# EAGLE schematic common emitter-punto di lavoro (EAGLE 9.6.2)
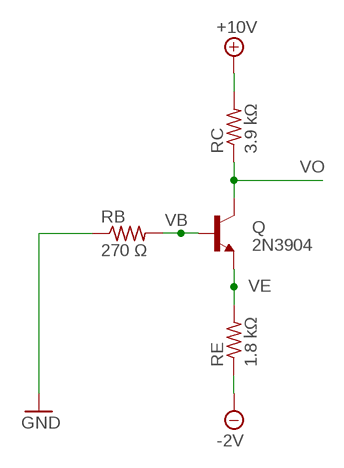
[diagram p0: schematic, sheet 1]

## Parts
Q  2N3904  [TO92]
RB  270 Ω  R-US_0204/5  [0204/5]
RC  3.9 kΩ  R-US_0204/5  [0204/5]
RE  1.8 kΩ  R-US_0204/5  [0204/5]

## Nets
+10V: RC.2
-10V: RE.1
GND: RB.1
VB: Q.2(B) RB.2
VE: Q.3(E) RE.2
VO: Q.1(C) RC.1

## Notes on the sheet
- -2V

## Library data of the parts
Q = transistor:2N3904: NPN TRANSISTOR
RB RC RE = rcl:R-US_: RESISTOR, American symbol; SPICEPREFIX: R